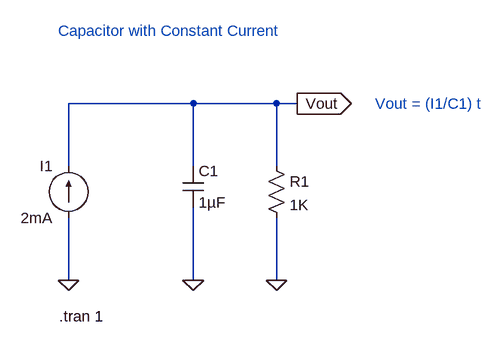
[diagram p0: schematic 7. Capacitor with CC.asc]
7. Capacitor with CC.asc, the LTspice schematic file:
Version 4
SHEET 1 880 680
WIRE 64 64 -128 64
WIRE 192 64 64 64
WIRE 224 64 192 64
WIRE -128 160 -128 64
WIRE 64 160 64 64
WIRE 192 160 192 64
WIRE -128 336 -128 240
WIRE 64 336 64 224
WIRE 192 336 192 240
FLAG -128 336 0
FLAG 64 336 0
FLAG 224 64 Vout
IOPIN 224 64 Out
FLAG 192 336 0
SYMBOL cap 48 160 R0
SYMATTR InstName C1
SYMATTR Value 1µF
SYMBOL current -128 240 R180
WINDOW 0 24 80 Left 2
WINDOW 3 24 0 Left 2
WINDOW 123 0 0 Left 0
WINDOW 39 0 0 Left 0
SYMATTR InstName I1
SYMATTR Value 2mA
SYMBOL res 176 144 R0
SYMATTR InstName R1
SYMATTR Value 1K
TEXT -142 392 Left 2 !.tran 1
TEXT -144 -48 Left 2 ;Capacitor with Constant Current
TEXT 344 64 Left 2 ;Vout = (I1/C1) t

The netlist it stands for:
* 7. Capacitor with CC.asc
C1 Vout 0 1µF
I1 0 Vout 2mA
R1 Vout 0 1K
.tran 1
* Capacitor with Constant Current
* Vout = (I1/C1) t
.backanno
.end